# EAGLE design canbus_boosterpack-iso1050-v1 (EAGLE 5.11)
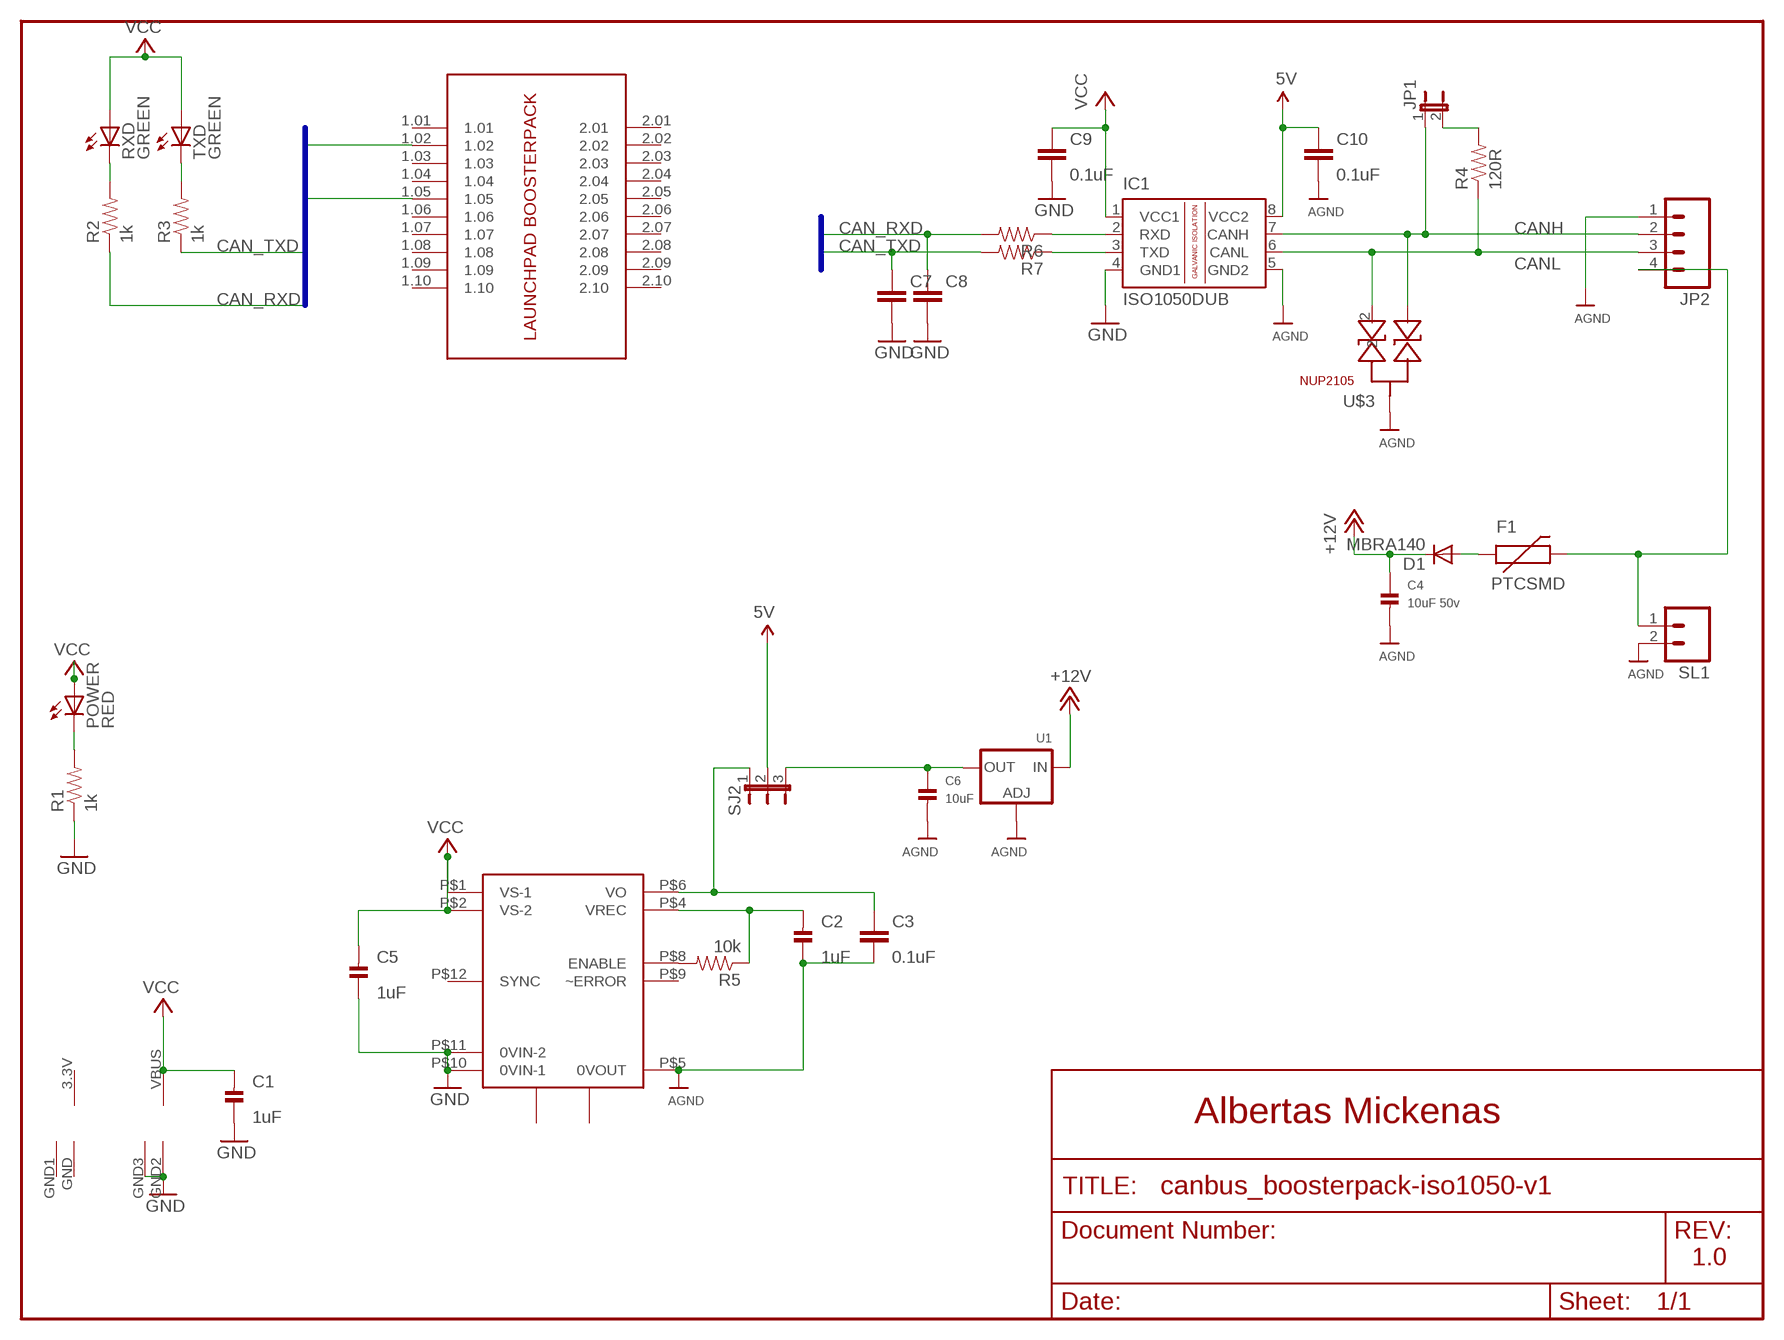
[diagram p0: schematic, sheet 1]

## Parts
C1  1uF  CAP_CERAMIC0805  [0805]
C2  1uF  CAP_CERAMIC0805  [0805]
C3  0.1uF  CAP0603-CAP  [0603-CAP]
C4  10uF 50v  CAP_CERAMIC0805  [0805]
C5  1uF  CAP_CERAMIC0805  [0805]
C6  10uF  CAP_CERAMIC0805  [0805]
C7  CAP0603-CAP  [0603-CAP]
C8  CAP0603-CAP  [0603-CAP]
C9  0.1uF  CAP0603-CAP  [0603-CAP]
C10  0.1uF  CAP0603-CAP  [0603-CAP]
D1  MBRA140  DIODESMA  [SMA-DIODE]
F1  PTCSMD  [PTC-1206]
IC1  ISO1050DUB  [DUB-R-PDSO-G8]
JP1  JUMPER2  [JUMPER2]
JP2  M04LONGPADS  [1X04_LONGPADS]
POWER  RED  LED-0805  [LED-805]
R1  1k  RESISTOR0603-RES  [0603-RES]
R2  1k  RESISTOR0603-RES  [0603-RES]
R3  1k  RESISTOR0603-RES  [0603-RES]
R4  120R  RESISTOR0603-RES  [0603-RES]
R5  10k  RESISTOR0603-RES  [0603-RES]
R6  RESISTOR0603-RES  [0603-RES]
R7  RESISTOR0603-RES  [0603-RES]
RXD  GREEN  LED-0805  [LED-805]
SJ2  JUMPER3  [JUMPER3]
SL1  M02  [02P]
TXD  GREEN  LED-0805  [LED-805]
U1  LM1117SOT223-REFLOW  [SOT223-R]
U$2  DCR01  [DVB]
U$3  NUP2105L  [DBZ_R-PDSO-G3]
U$4  LAUNCHPAD-BOOSTERPACK  [BOOSTERPACK]

## Nets
5V: C10.2 IC1.8(VCC2) SJ2.2
+12V: C4.1 D1.C U1.3(IN)
AGND: C2.1 C3.1 C4.2 C6.2 C10.1 IC1.5(GND2) JP2.1 SL1.2 U1.1(ADJ) U$2.P$5(0VOUT) U$3.3
CAN_RXD: C8.2 R2.1 R6.2 U$4.1.05
CAN_TXD: C7.2 R3.1 R7.2 U$4.1.02
CANH: IC1.7(CANH) JP1.1 JP2.2 U$3.1
CANL: IC1.6(CANL) JP2.3 R4.1 U$3.2
GND: C1.1 C5.1 C7.1 C8.1 C9.1 IC1.4(GND1) R1.1 U$2.P$10(0VIN-1) U$2.P$11(0VIN-2) U$4.GND2(POWER_VBUS:GND) U$4.GND3(POWER_VBUS:GND1)
N$2: IC1.2(RXD) R6.1
N$3: JP1.2 R4.2
N$4: POWER.C R1.2
N$5: R2.2 RXD.C
N$6: R3.2 TXD.C
N$7: C6.1 SJ2.3 U1.2(OUT)
N$8: IC1.3(TXD) R7.1
N$12: C3.2 SJ2.1 U$2.P$6(VO)
N$13: F1.2 JP2.4 SL1.1
N$14: C2.2 R5.1 U$2.P$4(VREC)
N$15: R5.2 U$2.P$8(ENABLE)
N$16: D1.A F1.1
VCC: C1.2 C5.2 C9.2 IC1.1(VCC1) POWER.A RXD.A TXD.A U$2.P$1(VS-1) U$2.P$2(VS-2) U$4.VBUS(POWER_VBUS:VDD)
Unconnected: U$2.P$3(NC) U$2.P$7(DNC) U$2.P$9(~ERROR) U$2.P$12(SYNC) U$4.1.01 U$4.1.03 U$4.1.04 U$4.1.06 U$4.1.07 U$4.1.08 U$4.1.09 U$4.1.10 U$4.2.01 U$4.2.02 U$4.2.03 U$4.2.04 U$4.2.05 U$4.2.06 U$4.2.07 U$4.2.08 U$4.2.09 U$4.2.10

## Buses
CAN_TXD,CAN_RXD

## Notes on the sheet
- Albertas Mickenas
- 1.0

## Power pins joined to a net without a drawn wire
GND: U$4.GND(POWER_3.3V:GND)
GND1: U$4.GND1(POWER_3.3V:GND1)
VDD: U$4.3.3V(POWER_3.3V:VDD)

## Library data of the parts
C1 C2 C4-C6 = microbuilder:CAP_CERAMIC: Ceramic Capacitors 0402 - 0402 Surface Mount Capacitors 16pF 50V 5% [Digikey: 445-4899-2-ND] 18pF 50V 5% [Digikey: 490-1281-2-ND] 22pF 50V 5% [Digikey: 490-1283-2-ND] 68pF 50V 5% [Digikey: 490-1289-2-ND] 0.1uF 10V 10% [Digikey: 490-1318-2-ND] 1.0uF 6.3V 10% [Digikey: 490-1320-2-ND] 0603 - 0603 Surface Mount Capacitors 16 pF 50V 5% [Digikey: 445-5051-2-ND] 22 pF 50V [Digikey: PCC220ACVTR-ND] 33 pF 50V 5% [Digikey: 490-1415-1-ND] 56pF 50V 5% [Digikey: 490-1421-1-ND] 220pF 50V 5% [Digikey: 445-1285-1-ND] 680 pF 50V 2200 pF 50V 5% C0G [Digikey: 445-1297-1-ND] 5600 pF 100V 5% X7R [Digikey: 478-3711-1-ND] 0.1 µF 25V 10% [Digikey: PCC2277TR-ND] 0.22 µF 16V 10% X7R [Digikey: 445-1318-1-ND] 1.0 µF 25V 10% [Digikey: 445-5146-2-ND] 0603 - RF Specific 3pF 250V +/-0.1pF RF [Digikey: 712-1347-1-ND] 18 pF 250V 5% [Digikey: 478-3505-1-ND or 712-1322-1-ND] 56 pF 250V 5% C0G RF [Digikey: 490-4867-1-ND] 68 pF 250V RF [Digikey: 490-4868-1-ND] 0805 - 0805 Surface Mount Capacitors 220 pF 250V 2% RF Ceramic Capacitor [Digikey: 712-1398-1-ND] 1000 pF 50V 2% NP0 Ceramic Capacitor [Digikey: 478-3760-1-ND] 0.1 µF 25V 10% Ceramic Capacitor [Digikey: PCC1828TR-ND] 1.0 µF 16V 10% Ceramic Capacitor[Digikey: 490-1691-2-ND] 10.0 µF 10V 10% Ceramic Capacitor[Digikey: 709-1228-1-ND] 10.0 uF 16V 10% Ceramic Capacitor [Digikey: 478-5165-2-ND] 47 uF 6.3V 20% Ceramic Capacitor [Digikey: 587-1779-1-ND or 399-5506-1-ND] 1206 - 1206 Surface Mount Capacitors 47uF 10V 20% Ceramic Capacitor [Digikey: 490-5528-1-ND or 399-5508-1-ND or 445-6010-1-ND]
C3 C7-C10 = SparkFun:CAP: Capacitor Standard 0603 ceramic capacitor, and 0.1" leaded capacitor.
D1 = SparkFun:DIODE: Diode These are standard reverse protection diodes and small signal diodes. SMA package can handle up to about 1A. SOD-323 can handle about 200mA. What the SOD-323 package when ordering, there are some mfgs out there that are 5-pin packages.
F1 = SparkFun:PTC: Resettable Fuse PTC Resettable Fuse. Spark Fun Electronics SKU : COM-08357
IC1 = texas:ISO1050: ISOLATED CAN TRANSCEIVER Source: http://focus.ti.com/lit/ds/symlink/iso1050.pdf; MPN: ISO1050DUBR; OC_FARNELL: 1755712; OC_NEWARK: 14R9899
JP1 = microbuilder:JUMPER2: JUMPER - 2 Pins
JP2 = SparkFun:M04: Header 4 Standard 4-pin 0.1" header. Use with straight break away headers (SKU : PRT-00116), right angle break away headers (PRT-00553), swiss pins (PRT-00743), machine pins (PRT-00117), and female headers (PRT-00115). Molex polarized connector foot print use with SKU : PRT-08231 with associated crimp pins and housings. 1MM SMD Version SKU: PRT-10208
POWER RXD TXD = dp_devices:LED: Light Emitting Diode
R1-R7 = SparkFun:RESISTOR: Resistor Basic schematic elements and footprints for 0603, 1206, and PTH resistors.
SJ2 = microbuilder:JUMPER3: JUMPER - 3 Pins
SL1 = con-amp-quick:M02: AMP QUICK CONNECTOR; OC_FARNELL: unknown; OC_NEWARK: unknown
U1 = microbuilder:LM1117: LM1117 Voltage Regulator LM1117 Adjustable Voltage regulator [Digikey: LM1117IMP-ADJDKR-ND] LM1117 3.3V Voltage regulator [AP1117E33GDIDKR-ND] LM1117 5.0V Voltage regulator [AP1117E50GDIDKR-ND] SOT223-REFLOW - SOT223 package for solder paste/reflow ovens SOT223-WAVE - SOT223 package for hand-soldering (larger pads) Note: For the fixed-voltage regulators, simply set the ADJ pin to GND.
U$2 = mic-misc:DCR01
U$3 = mic-misc:NUP2105L
U$4 = mic-misc:LAUNCHPAD-BOOSTERPACK

## Board
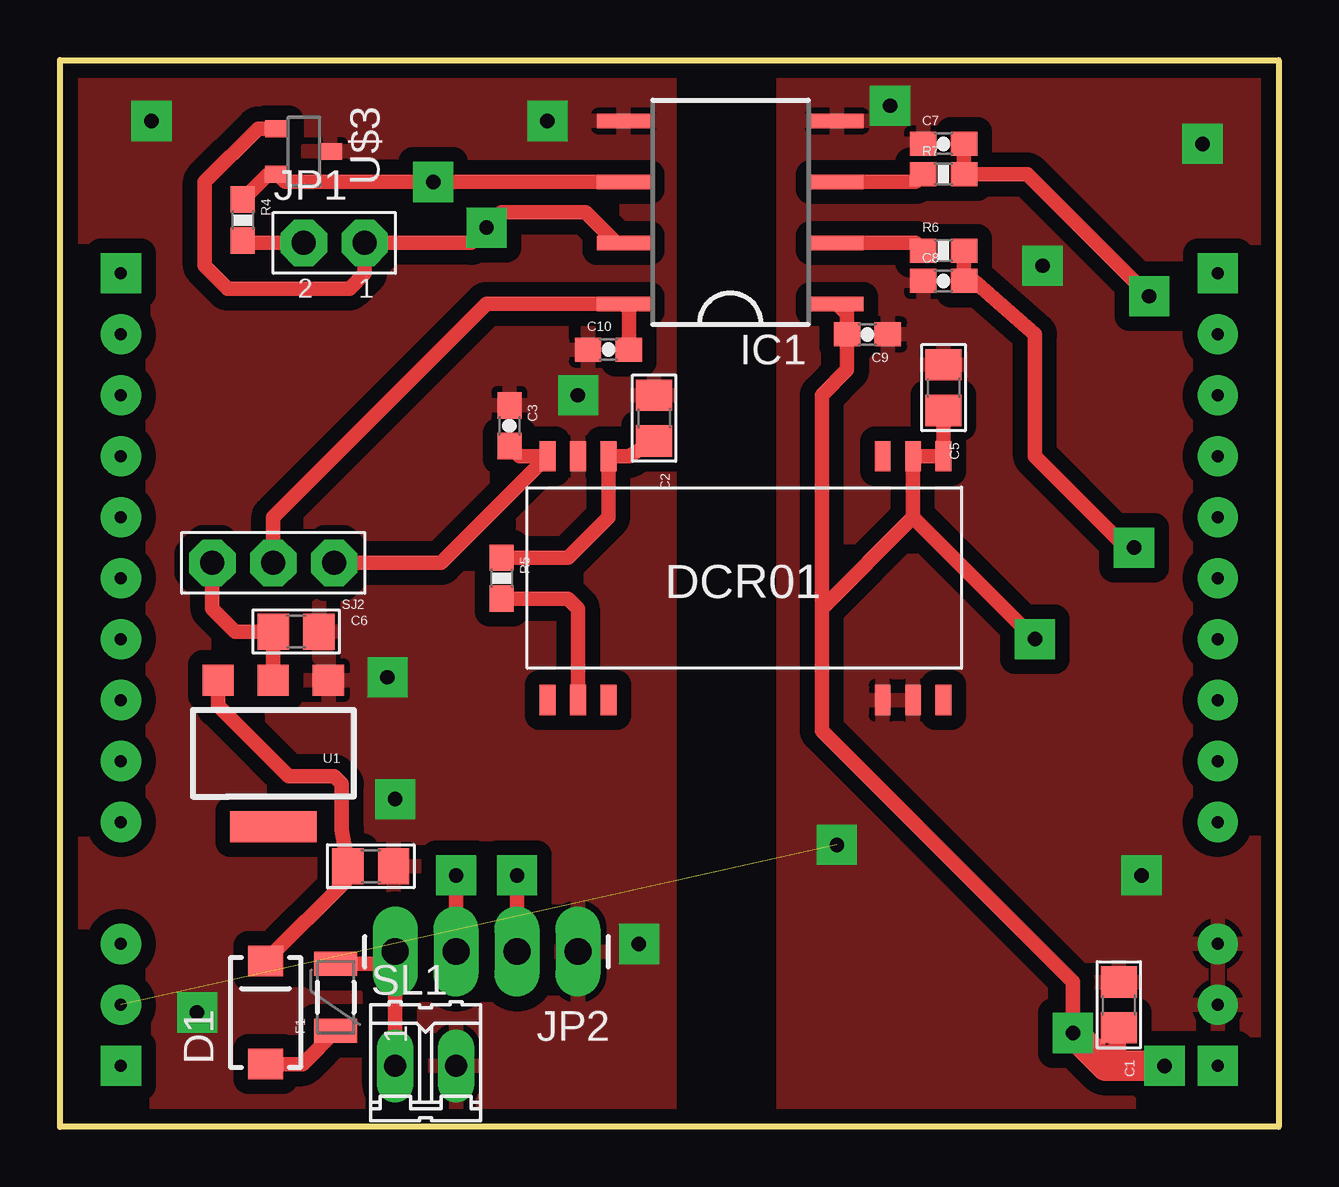
[diagram p1: board, top side]
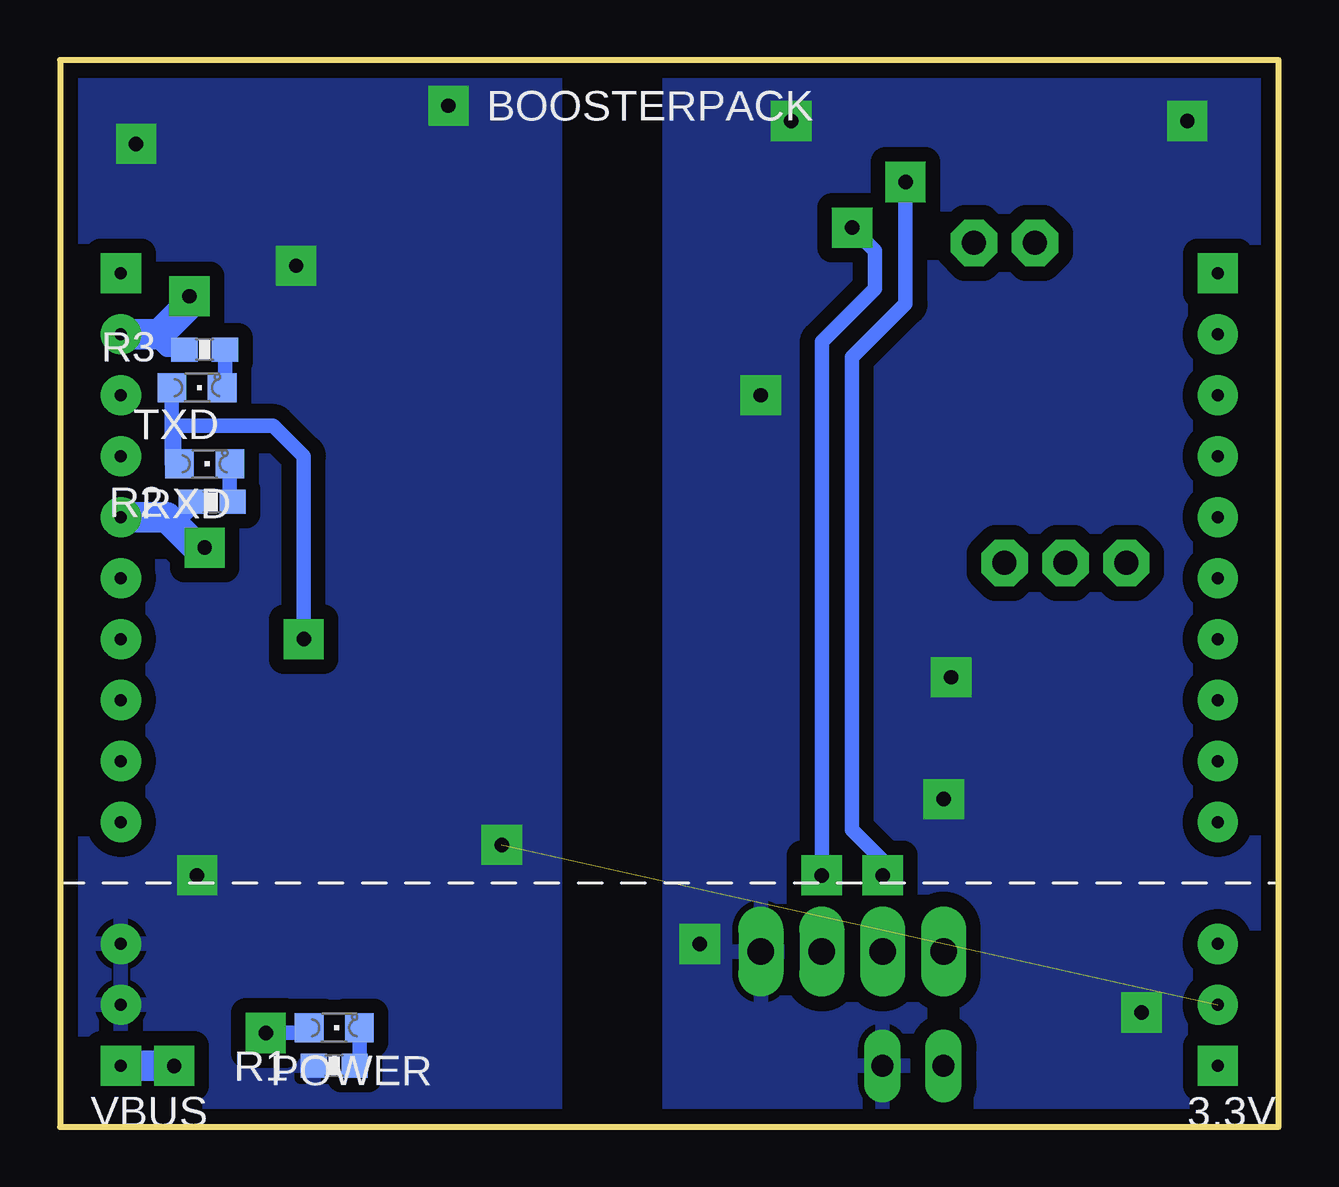
[diagram p2: board, bottom side, seen from below]

Size 50.8 x 44.45 mm. Coordinates in mm from the lower left corner, seen from the top.
Outline: 0,0 0,44.45 50.8,44.45 50.8,0 0,0
Copper layers (1*16): Top 0.035mm / dielectric 1.5mm / Bottom 0.035mm
Design rules "SparkFun": minimum track width 8mil, minimum drill 20mil, track to track 8mil, track to pad 8mil, pad to pad 8mil, via to via 8mil, smd to smd 8mil, copper to edge 8mil, drill to drill 8mil, minimum pad ring 12mil, minimum via ring 10mil, stop-mask expansion 4mil, vias tented up to drill 20mil, thermal gap 10mil

### Footprints (pad centres in the part's own frame; a part is rotated, then mirrored left to right if it is on the bottom)
0805 = smd 1.3 x 1.5: 1 -0.95,0; 2 0.95,0
0603-CAP = smd 1.1 x 1: 1 -0.85,0; 2 0.85,0
SMA-DIODE = smd 1.27 x 1.47: A -2.15,0; C 2.15,0
PTC-1206 = smd 1 x 1.8: 1 -1.4,0; 2 1.4,0
DUB-R-PDSO-G8 = smd 0.6 x 2.2: 1 -3.81,-4.445; 2 -1.27,-4.445; 3 1.27,-4.445; 4 3.81,-4.445; 5 3.81,4.445; 6 1.27,4.445; 7 -1.27,4.445; 8 -3.81,4.445
JUMPER2 = drill 1 pad 1.93 octagon: 1 2.54,0; 2 0,0
1X04_LONGPADS = drill 1.118 pad 1.88 long: 1 0,0; 2 2.54,0; 3 5.08,0; 4 7.62,0
LED-805 = smd 1.2 x 1.2: A 0,-1.05; C 0,1.05
0603-RES = smd 1.1 x 1: 1 -0.85,0; 2 0.85,0
JUMPER3 = drill 1 pad 1.93 octagon: 1 -2.54,0; 2 0,0; 3 2.54,0
02P = drill 0.914 long: 1 -1.27,0; 2 1.27,0
SOT223-R = smd 1.3 x 1.3: 1 -2.3,-3.05; 2 0,-3.05; 3 2.3,-3.05 | smd 3.6 x 1.3: 4 0,3.05
DVB = smd 0.66 x 1.27: P$1 0,1.27; P$2 1.27,1.27; P$3 2.54,1.27; P$4 13.97,1.27; P$5 15.24,1.27; P$6 16.51,1.27; P$7 16.51,11.43; P$8 15.24,11.43; P$9 13.97,11.43; P$10 2.54,11.43; P$11 1.27,11.43; P$12 0,11.43
DBZ_R-PDSO-G3 = smd 0.7 x 1: 1 -0.95,-1.1; 2 0.95,-1.1; 3 0,1.1
BOOSTERPACK = drill 0.5 pad 1.676 square: 1.01 -21.59,11.43; 2.01 24.13,11.43; 3.3V 24.13,-21.59; VBUS -21.59,-21.59 | drill 0.5 pad 1.676 round: 1.02 -21.59,8.89; 1.03 -21.59,6.35; 1.04 -21.59,3.81; 1.05 -21.59,1.27; 1.06 -21.59,-1.27; 1.07 -21.59,-3.81; 1.08 -21.59,-6.35; 1.09 -21.59,-8.89; 1.10 -21.59,-11.43; 2.02 24.13,8.89; 2.03 24.13,6.35; 2.04 24.13,3.81; 2.05 24.13,1.27; 2.06 24.13,-1.27; 2.07 24.13,-3.81; 2.08 24.13,-6.35; 2.09 24.13,-8.89; 2.10 24.13,-11.43; GND 24.13,-19.05; GND1 24.13,-16.51; GND2 -21.59,-19.05; GND3 -21.59,-16.51

### Placement (x,y rotation side)
C1  44.13,5.08 270 top
C2  24.77,29.53 270 top
C3  18.73,29.21 270 top
C4  12.95,10.86 0 top
C5  36.83,30.8 270 top
C6  9.84,20.64 0 top
C7  36.83,40.96 0 top
C8  36.83,35.24 0 top
C9  33.66,33.02 180 top
C10  22.86,32.38 0 top
D1  8.57,4.76 90 top
F1  11.49,5.4 90 top
IC1  27.94,38.1 90 top
JP1  10.16,36.83 0 top
JP2  21.59,7.3 180 top
POWER  39.37,4.13 270 bottom
R1  39.37,2.54 0 bottom
R2  44.45,26.04 0 bottom
R3  44.77,32.38 0 bottom
R4  7.62,37.78 270 top
R5  18.41,22.86 270 top
R6  36.83,36.51 0 top
R7  36.83,39.69 0 top
RXD  44.77,27.62 270 bottom
SJ2  8.89,23.5 180 top
SL1  15.24,2.54 0 top
TXD  45.09,30.8 270 bottom
U1  8.89,15.56 180 top
U$2  36.83,29.21 180 top
U$3  10.16,40.64 270 top
U$4  26.67,24.13 0 bottom

### Tracks (layer width: path | path; a pad name or v marks a point on that pad's centre or on a via)
5V
  Top 0.61: SJ2.2 8.89,25.4 17.78,34.29 IC1.8 23.71,34.08 C10.2
+12V
  Top 0.61: D1.C 12,10.34 C4.1 11.75,12.38 11.75,14.29 11.43,14.61 9.53,14.61 6.59,17.54 U1.3
AGND  (via drill 0.6 pad 1.68)
  other vias: 5.71,4.76 24.13,7.62 20.32,41.91 21.59,30.48 13.65,18.73 13.97,13.65 3.81,41.91
  pour Top (isolate 0.61): 0,44.45 25.4,44.45 25.4,0 0,0
  pour Bottom (isolate 0.61): 0,44.45 25.4,44.45 25.4,0 0,0
CAN_RXD  (via drill 0.6 pad 1.68)
  Top 0.61: R6.2 C8.2 38.1,35.24 40.64,33.02 40.64,27.94 44.45,24.13 v44.77,24.13
  Bottom 0.61: R2.1 45.3,25.82 46.04,25.08
  Bottom 1.27: v44.77,24.13 45.09,24.13 46.04,25.08 46.35,25.4 U$4.1.05
CAN_TXD  (via drill 0.6 pad 1.68)
  Top 0.61: v45.4,34.61 40.32,39.69 R7.2 C7.2
  Bottom 0.61: R3.1 46.35,32.38 46.99,33.02
  Bottom 1.27: v45.4,34.61 45.4,34.29 46.67,33.02 46.99,33.02 U$4.1.02
CANH  (via drill 0.6 pad 1.68)
  Top 0.61: IC1.7 23.18,36.83 21.91,38.1 18.41,38.1 v17.78,37.47 17.14,36.83 JP1.1 12.7,35.56 12.06,34.92 6.99,34.92 6.03,35.88 6.03,39.37 8.26,41.59 U$3.1 | JP2.2 v19.05,10.48
  Bottom 0.61: v19.05,10.48 19.05,32.7 16.83,34.92 16.83,36.51 v17.78,37.47
CANL  (via drill 0.6 pad 1.68)
  Top 0.61: U$3.2 9.38,39.37 | U$3.2 8.68,39.69 R4.1 | JP2.3 v16.51,10.48 | IC1.6 v15.56,39.37 9.53,39.37 9.21,39.69 U$3.2
  Bottom 0.61: v16.51,10.48 16.51,11.11 17.78,12.38 17.78,32.07 15.56,34.29 v15.56,39.37
GND  (via drill 0.6 pad 1.68)  (1 unrouted)
  other vias: 40.96,35.88 34.61,42.55 45.09,10.48 32.38,11.75 47.62,40.96
  pour Top (isolate 0.61): 30.16,44.45 50.8,44.45 50.8,0 30.16,0
  pour Bottom (isolate 0.61): 30.16,44.45 50.8,44.45 50.8,0 30.16,0
N$2
  Top 0.61: IC1.2 35.66,36.83 R6.1
N$3
  Top 0.61: JP1.2 7.72,36.83 R4.2
N$4
  Bottom 0.61: POWER.C 38.32,2.74 R1.2
N$5
  Bottom 0.61: RXD.C 43.72,25.84 R2.2
N$6
  Bottom 0.61: R3.2 43.92,30.91 TXD.C
N$7
  Top 0.61: SJ2.3 6.35,21.59 7.3,20.64 C6.1 U1.2
N$8
  Top 0.61: IC1.3 35.66,39.37 R7.1
N$12
  Top 0.61: C3.2 19.15,27.94 U$2.P$6 15.88,23.5 SJ2.1
N$13
  Top 0.61: SL1.1 JP2.4 13.46,6.8 F1.2
N$14
  Top 0.61: R5.1 21.17,23.71 22.86,25.4 U$2.P$4 23.71,27.94 C2.2
N$15
  Top 0.61: R5.2 21.17,22.01 21.59,21.59 U$2.P$8
N$16
  Top 0.61: F1.1 10.11,2.61 D1.A
VCC  (via drill 0.6 pad 1.68)
  Top 0.61: C5.2 U$2.P$1 U$2.P$2 35.56,25.4 | 31.75,21.59 31.75,16.51 42.22,6.04 v42.22,3.91 | 43.39,2.75 43.81,3.17 | 35.56,25.4 v40.64,20.32 | 31.75,21.59 35.56,25.4 | 31.75,21.59 31.75,30.48 32.8,31.54 C9.2 32.8,33.87 IC1.1 | C1.2 44.13,2.86 44.45,2.54
  Top 1.27: v46.04,2.54 44.45,2.54 43.59,2.54 43.39,2.75 v42.22,3.91
  Bottom 0.61: v42.22,3.91 40.63,3.91 POWER.A | TXD.A 46.13,27.62 RXD.A 46.04,27.52 46.04,29.21 41.91,29.21 40.64,27.94 v40.64,20.32
  Bottom 1.27: v46.04,2.54 U$4.VBUS

### Text on the board
tValues: Sukking Pang and Ryan Owens